# Altium schematic sheet OfflineSWD.SchDoc
size A3
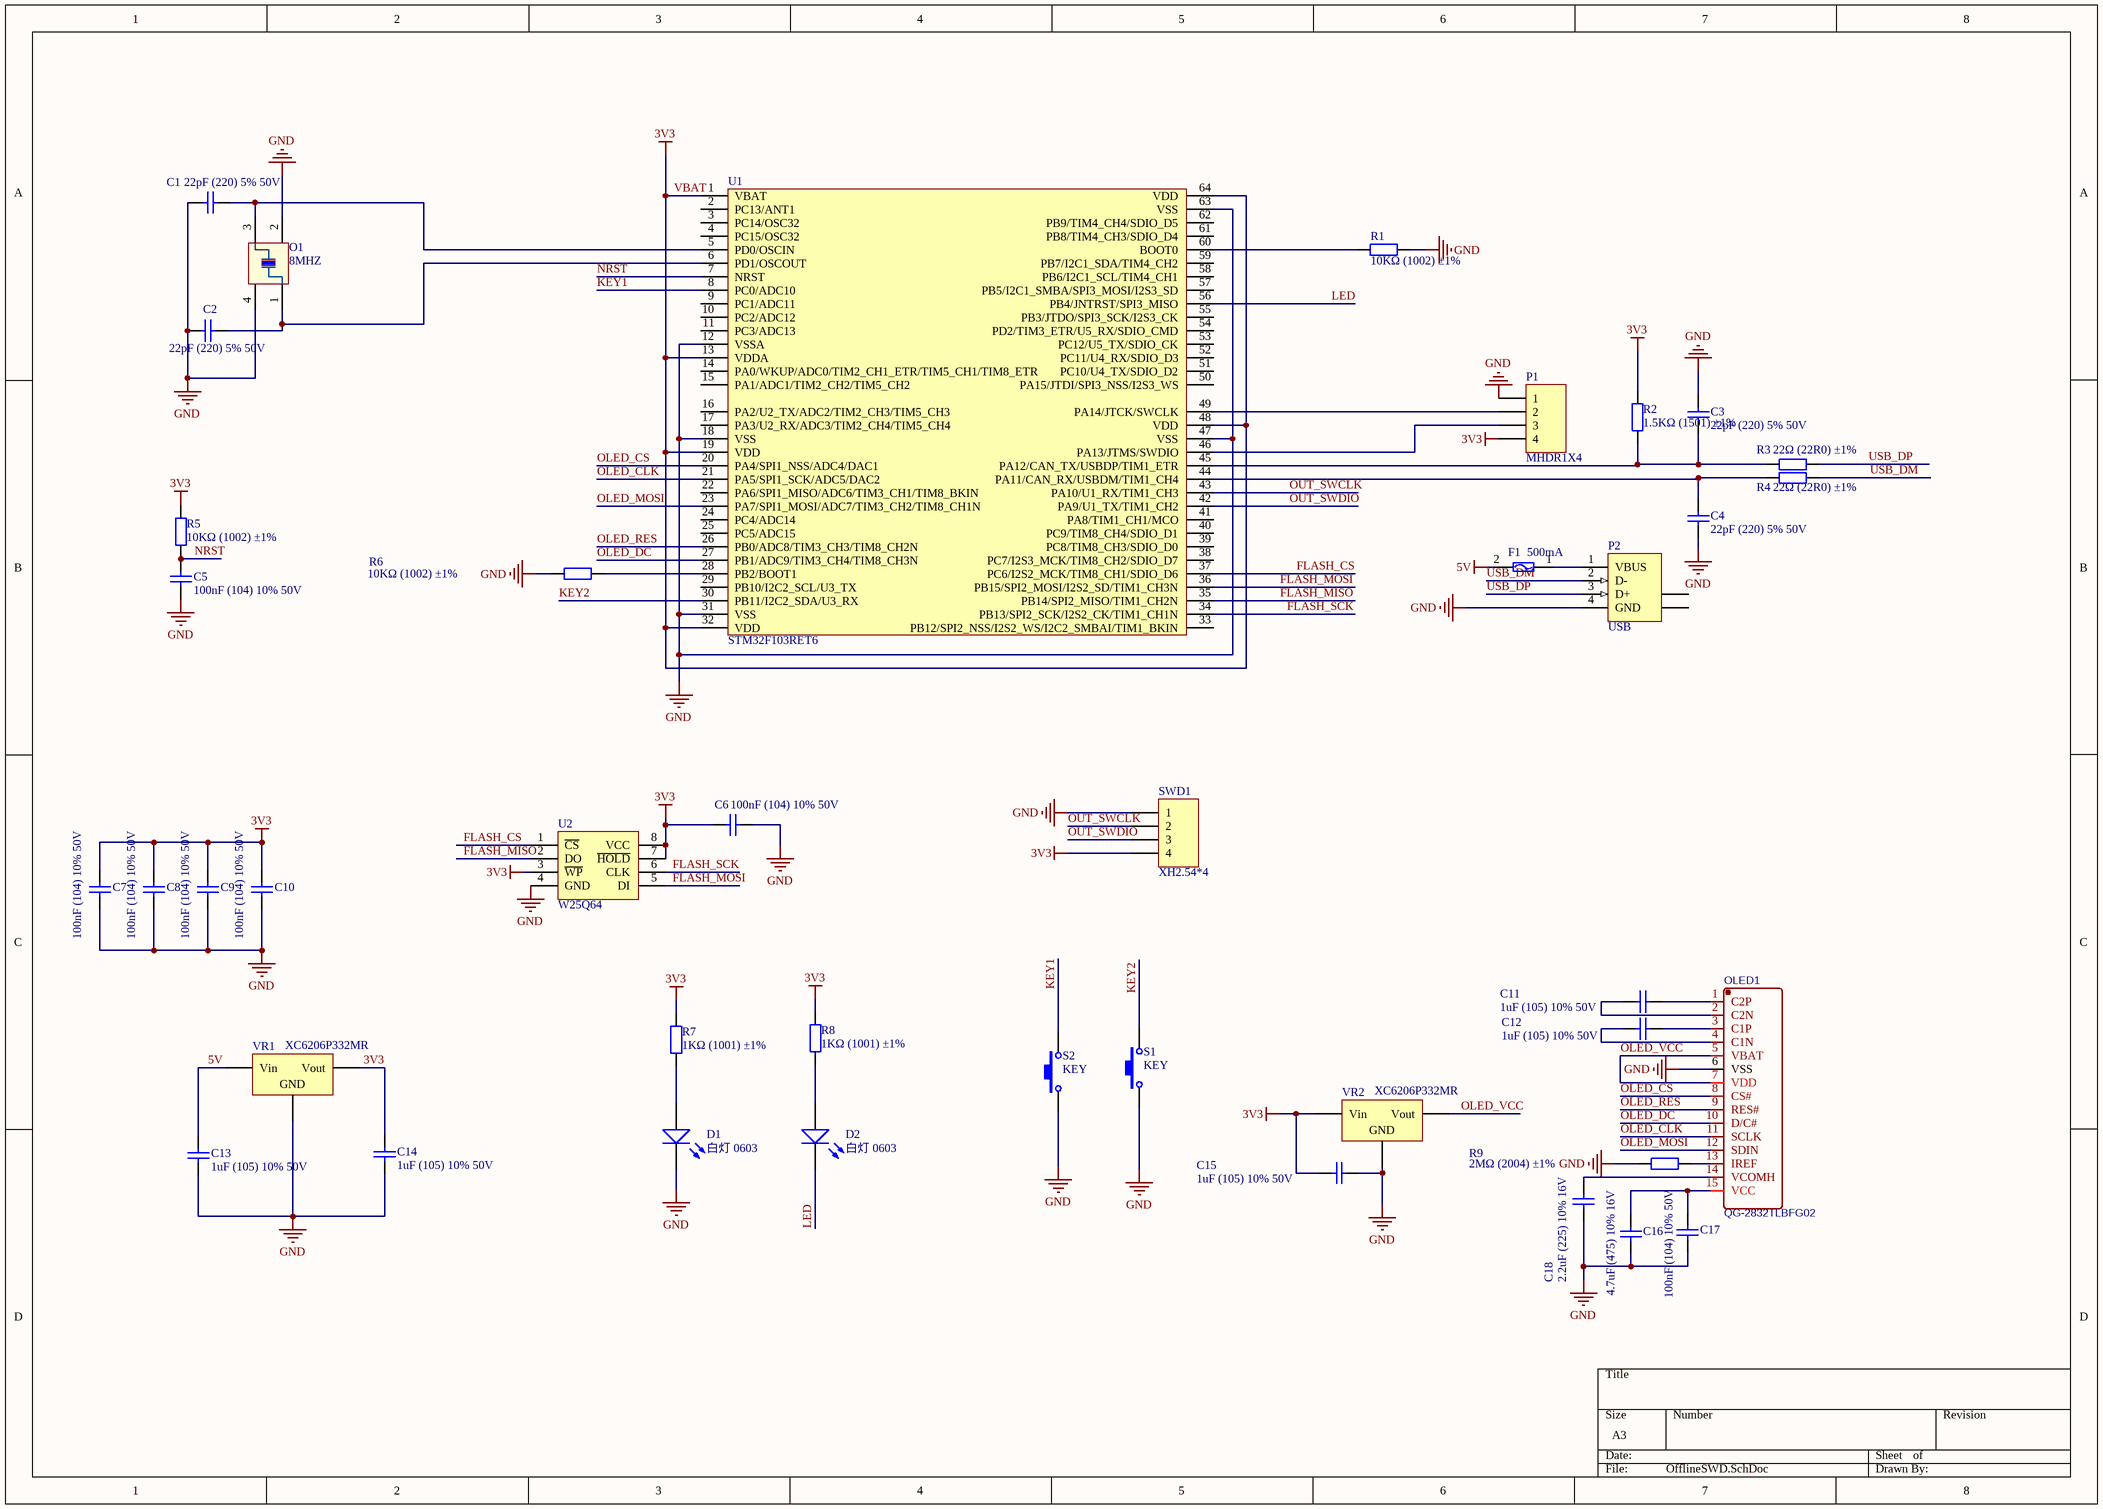
[diagram p0: OfflineSWD.SchDoc]

## Parts
C1  22pF (220) 5% 50V  [0603_C]
C2  22pF (220) 5% 50V  [0603_C]
C3  22pF (220) 5% 50V  [0603_C]
C4  22pF (220) 5% 50V  [0603_C]
C5  100nF (104) 10% 50V  [0603_C]
C6  100nF (104) 10% 50V  [0603_C]
C7  100nF (104) 10% 50V  [0603_C]
C8  100nF (104) 10% 50V  [0603_C]
C9  100nF (104) 10% 50V  [0603_C]
C10  100nF (104) 10% 50V  [0603_C]
C11  1uF (105) 10% 50V  [0603_C]
C12  1uF (105) 10% 50V  [0603_C]
C13  1uF (105) 10% 50V  [0603_C]
C14  1uF (105) 10% 50V  [0603_C]
C15  1uF (105) 10% 50V  [0603_C]
C16  4.7uF (475) 10% 16V  [0603_C]
C17  100nF (104) 10% 50V  [0603_C]
C18  2.2uF (225) 10% 16V  [0603_C]
D1  白灯 0603  [0603_LED_S1]
D2  白灯 0603  [0603_LED_S1]
F1  500mA  [0805]
O1  8MHZ  [3225]
OLED1  QG-2832TLBFG02  [0.91-OLED]
P1  MHDR1X4  [MHDR1X4]
P2  USB  [USB_A/P_B]
R1  10KΩ (1002) ±1%  [0603_R]
R2  1.5KΩ (1501) ±1%  [0603_R]
R3  22Ω (22R0) ±1%  [0603_R]
R4  22Ω (22R0) ±1%  [0603_R]
R5  10KΩ (1002) ±1%  [0603_R]
R6  10KΩ (1002) ±1%  [0603_R]
R7  1KΩ (1001) ±1%  [0603_R]
R8  1KΩ (1001) ±1%  [0603_R]
R9  2MΩ (2004) ±1%  [0603_R]
S1  KEY  [KEY]
S2  KEY  [KEY]
SWD1  XH2.54*4  [XH2.54-WI-4P]
U1  STM32F103RET6  [LQFP64]
U2  W25Q64  [SOP8_W]
VR1  XC6206P332MR  [SOT-23-3L]
VR2  XC6206P332MR  [SOT-23-3L]

## Nets
3V3: C6.1 C7.2 C8.2 C9.2 C10.2 C14.2 C15.1 P1.4 R2.1 R5.2 R7.2 R8.2 SWD1.4 U1.1(VBAT) U1.13(VDDA) U1.19(VDD) U1.32(VDD) U1.48(VDD) U1.64(VDD) U2.3(~{WP}) U2.7(~{HOLD}) U2.8(VCC) VR1.2(Vout) VR2.3(Vin)  [also labelled VBAT]
5V: C13.2 F1.2 VR1.3(Vin)
GND: C1.2 C2.2 C3.2 C4.1 C5.1 C6.2 C7.1 C8.1 C9.1 C10.1 C13.1 C14.1 C15.2 C16.1 C17.1 C18.1 D1.K O1.2 O1.4 OLED1.6(VSS) P1.1 P2.4(GND) R1.1 R6.1 R9.1 S1.1 S2.1 SWD1.1 U1.12(VSSA) U1.18(VSS) U1.31(VSS) U1.47(VSS) U1.63(VSS) U2.4(GND) VR1.1(GND) VR2.1(GND)
FLASH_CS: U1.37(PC6/I2S2_MCK/TIM8_CH1/SDIO_D6) U2.1(~{CS})
FLASH_MISO: U1.35(PB14/SPI2_MISO/TIM1_CH2N) U2.2(DO)
FLASH_MOSI: U1.36(PB15/SPI2_MOSI/I2S2_SD/TIM1_CH3N) U2.5(DI)
FLASH_SCK: U1.34(PB13/SPI2_SCK/I2S2_CK/TIM1_CH1N) U2.6(CLK)
KEY1: S2.2 U1.8(PC0/ADC10)
KEY2: S1.2 U1.30(PB11/I2C2_SDA/U3_RX)
LED: D2.K U1.56(PB4/JNTRST/SPI3_MISO)
NRST: C5.2 R5.1 U1.7(NRST)
OLED_CLK: OLED1.11(SCLK) U1.21(PA5/SPI1_SCK/ADC5/DAC2)
OLED_CS: OLED1.8(CS#) U1.20(PA4/SPI1_NSS/ADC4/DAC1)
OLED_DC: OLED1.10(D/C#) U1.27(PB1/ADC9/TIM3_CH4/TIM8_CH3N)
OLED_MOSI: OLED1.12(SDIN) U1.23(PA7/SPI1_MOSI/ADC7/TIM3_CH2/TIM8_CH1N)
OLED_RES: OLED1.9(RES#) U1.26(PB0/ADC8/TIM3_CH3/TIM8_CH2N)
OLED_VCC: OLED1.5(VBAT) OLED1.7(VDD) VR2.2(Vout)
OUT_SWCLK: SWD1.2 U1.43(PA10/U1_RX/TIM1_CH3)
OUT_SWDIO: SWD1.3 U1.42(PA9/U1_TX/TIM1_CH2)
USB_DM: P2.2(D-) R4.2
USB_DP: P2.3(D+) R3.2
NetC1_1: C1.1 O1.3 U1.5(PD0/OSCIN)
NetC2_1: C2.1 O1.1 U1.6(PD1/OSCOUT)
NetC3_1: C3.1 R2.2 R3.1 U1.45(PA12/CAN_TX/USBDP/TIM1_ETR)
NetC4_2: C4.2 R4.1 U1.44(PA11/CAN_RX/USBDM/TIM1_CH4)
NetC11_1: C11.1 OLED1.2(C2N)
NetC11_2: C11.2 OLED1.1(C2P)
NetC12_1: C12.1 OLED1.4(C1N)
NetC12_2: C12.2 OLED1.3(C1P)
NetC16_2: C16.2 C17.2 OLED1.15(VCC)
NetC18_2: C18.2 OLED1.14(VCOMH)
NetD1_A: D1.A R7.1
NetD2_A: D2.A R8.1
NetF1_1: F1.1 P2.1(VBUS)
NetOLED1_13: OLED1.13(IREF) R9.2
NetP1_2: P1.2 U1.49(PA14/JTCK/SWCLK)
NetP1_3: P1.3 U1.46(PA13/JTMS/SWDIO)
NetR1_2: R1.2 U1.60(BOOT0)
NetR6_2: R6.2 U1.28(PB2/BOOT1)

Not connected (* = marked no-connect by the designer): P2 5(SHLD) 6(SHLD); U1 2(PC13/ANT1) 3(PC14/OSC32) 4(PC15/OSC32) 9(PC1/ADC11) 10(PC2/ADC12) 11(PC3/ADC13) 14(PA0/WKUP/ADC0/TIM2_CH1_ETR/TIM5_CH1/TIM8_ETR) 15(PA1/ADC1/TIM2_CH2/TIM5_CH2) 16(PA2/U2_TX/ADC2/TIM2_CH3/TIM5_CH3) 17(PA3/U2_RX/ADC3/TIM2_CH4/TIM5_CH4) 22(PA6/SPI1_MISO/ADC6/TIM3_CH1/TIM8_BKIN) 24(PC4/ADC14) 25(PC5/ADC15) 29(PB10/I2C2_SCL/U3_TX) 33(PB12/SPI2_NSS/I2S2_WS/I2C2_SMBAI/TIM1_BKIN) 38(PC7/I2S3_MCK/TIM8_CH2/SDIO_D7) 39(PC8/TIM8_CH3/SDIO_D0) 40(PC9/TIM8_CH4/SDIO_D1) 41(PA8/TIM1_CH1/MCO) 50(PA15/JTDI/SPI3_NSS/I2S3_WS) 51(PC10/U4_TX/SDIO_D2) 52(PC11/U4_RX/SDIO_D3) 53(PC12/U5_TX/SDIO_CK) 54(PD2/TIM3_ETR/U5_RX/SDIO_CMD) 55(PB3/JTDO/SPI3_SCK/I2S3_CK) 57(PB5/I2C1_SMBA/SPI3_MOSI/I2S3_SD) 58(PB6/I2C1_SCL/TIM4_CH1) 59(PB7/I2C1_SDA/TIM4_CH2) 61(PB8/TIM4_CH3/SDIO_D4) 62(PB9/TIM4_CH4/SDIO_D5)

## Library data of the parts
C1-C4 = 0603 22pF (220) 5%: 贴片电容; ComponentLink1Description: 供应商链接; ComponentLink1URL: http://www.szlcsc.com/product/details_2005.html; Package: 0603; Supplier: LC; SuppliersPartNumber: C1653
C5-C10 C17 = 0603 100nF (104) 10%: 贴片电容; ComponentLink1Description: 供应商链接; ComponentLink1URL: http://www.szlcsc.com/product/details_15331.html; Package: 0603; Supplier: LC; SuppliersPartNumber: C14663
C11-C15 = 0603 1uF (105) 10%: 贴片电容; ComponentLink1Description: 供应商链接; ComponentLink1URL: http://www.szlcsc.com/product/details_16531.html; Package: 0603; Supplier: LC; SuppliersPartNumber: C15849
C16 = 0603 4.7uF (475) 10%: 贴片电容; ComponentLink1Description: 供应商链接; ComponentLink1URL: http://www.szlcsc.com/product/details_20375.html; Package: 0603; Supplier: LC; SuppliersPartNumber: C19666
C18 = 0603 2.2uF (225) 10%: 贴片电容; ComponentLink1Description: 供应商链接; ComponentLink1URL: http://www.szlcsc.com/product/details_24366.html; Package: 0603; Supplier: LC; SuppliersPartNumber: C23630
D1 D2 = 0603 白灯: 发光二极管; ComponentLink1Description: 供应商链接; ComponentLink1URL: http://www.szlcsc.com/product/details_2663.html; Package: 0603; Supplier: LC; SuppliersPartNumber: C2290
F1 = FUSE: 保险丝，熔断丝
O1 = OSC
OLED1 = 0.91-OLED: BOM_Manufacturer: Allvision; Contributor: LCSC; BOM_Supplier: LCSC; BOM_Manufacturer Part: QG-2832TLBFG02; BOM_Supplier Part: C91220; spicePre: O; spiceSymbolName: QG-2832TLBFG02
P1 = MHDR1X4: Header, 4-Pin; LatestRevisionDate: 17-Jul-2002; LatestRevisionNote: Re-released for DXP Platform.; Publisher: Altium Limited
P2 = 1470695-2: USB 1.1, Right Angle, SMT, A Type, Plug, 4 Position, Natural; ContactMaterial: Brass; ContactPlating: Gold (30) over Nickel (50); PCB_Layout: Complies with manufacturer's recommendation.; DrillSize: Corresponds to nominal value.; PanelGround: Without; Published: 15-Jul-2004; DatasheetDocument: 21-Jan-2003; PackageDocument: 21-Jan-2003; PackageReference: 1470695A; Publisher: Altium Limited; HousingMaterial: Thermoplastic; ComponentLink1Description: Manufacturer Link; ComponentLink1URL: http://www.tycoelectronics.com/; ComponentLink2Description: Packaging Specification; ComponentLink2URL: http://ecommas.tycoelectronics.com/commerce/DocumentDelivery/DDEController?Action=showdoc&DocId=Customer+Drawing%7F1470695%7FO%7Fpdf%7FEnglish%7FC_1470695_O.pdf
R1 R5 R6 = 0603 10KΩ (10: 贴片电阻; ComponentLink1Description: 供应商链接; ComponentLink1URL: http://www.szlcsc.com/product/details_26547.html; Package: 0603; Supplier: LC; SuppliersPartNumber: C25804
R2 = 0603 1.5KΩ (15: 贴片电阻; ComponentLink1Description: 供应商链接; ComponentLink1URL: http://www.szlcsc.com/product/details_23570.html; Package: 0603; Supplier: LC; SuppliersPartNumber: C22843
R3 R4 = 0603 22Ω (22: 贴片电阻; ComponentLink1Description: 供应商链接; ComponentLink1URL: http://www.szlcsc.com/product/details_24078.html; Package: 0603; Supplier: LC; SuppliersPartNumber: C23345
R7 R8 = 0603 1KΩ (10: 贴片电阻; ComponentLink1Description: 供应商链接; ComponentLink1URL: http://www.szlcsc.com/product/details_21904.html; Package: 0603; Supplier: LC; SuppliersPartNumber: C21190
R9 = 0603 2MΩ (20: 贴片电阻; ComponentLink1Description: 供应商链接; ComponentLink1URL: http://www.szlcsc.com/product/details_23703.html; Package: 0603; Supplier: LC; SuppliersPartNumber: C22976
SWD1 = Header 4: Header, 4-Pin; LatestRevisionDate: 17-Jul-2002; LatestRevisionNote: Re-released for DXP Platform.; Publisher: Altium Limited
U1 = STM32F103RxT6
U2 = W25Q
VR1 VR2 = SOT-23 XC620: 低压差线性稳压(LDO); ComponentLink1Description: 供应商链接; ComponentLink1URL: http://www.szlcsc.com/product/details_5896.html; Package: SOT-23; Supplier: LC; SuppliersPartNumber: C5446